# EAGLE design tinyha_relay (EAGLE 7.5.0)
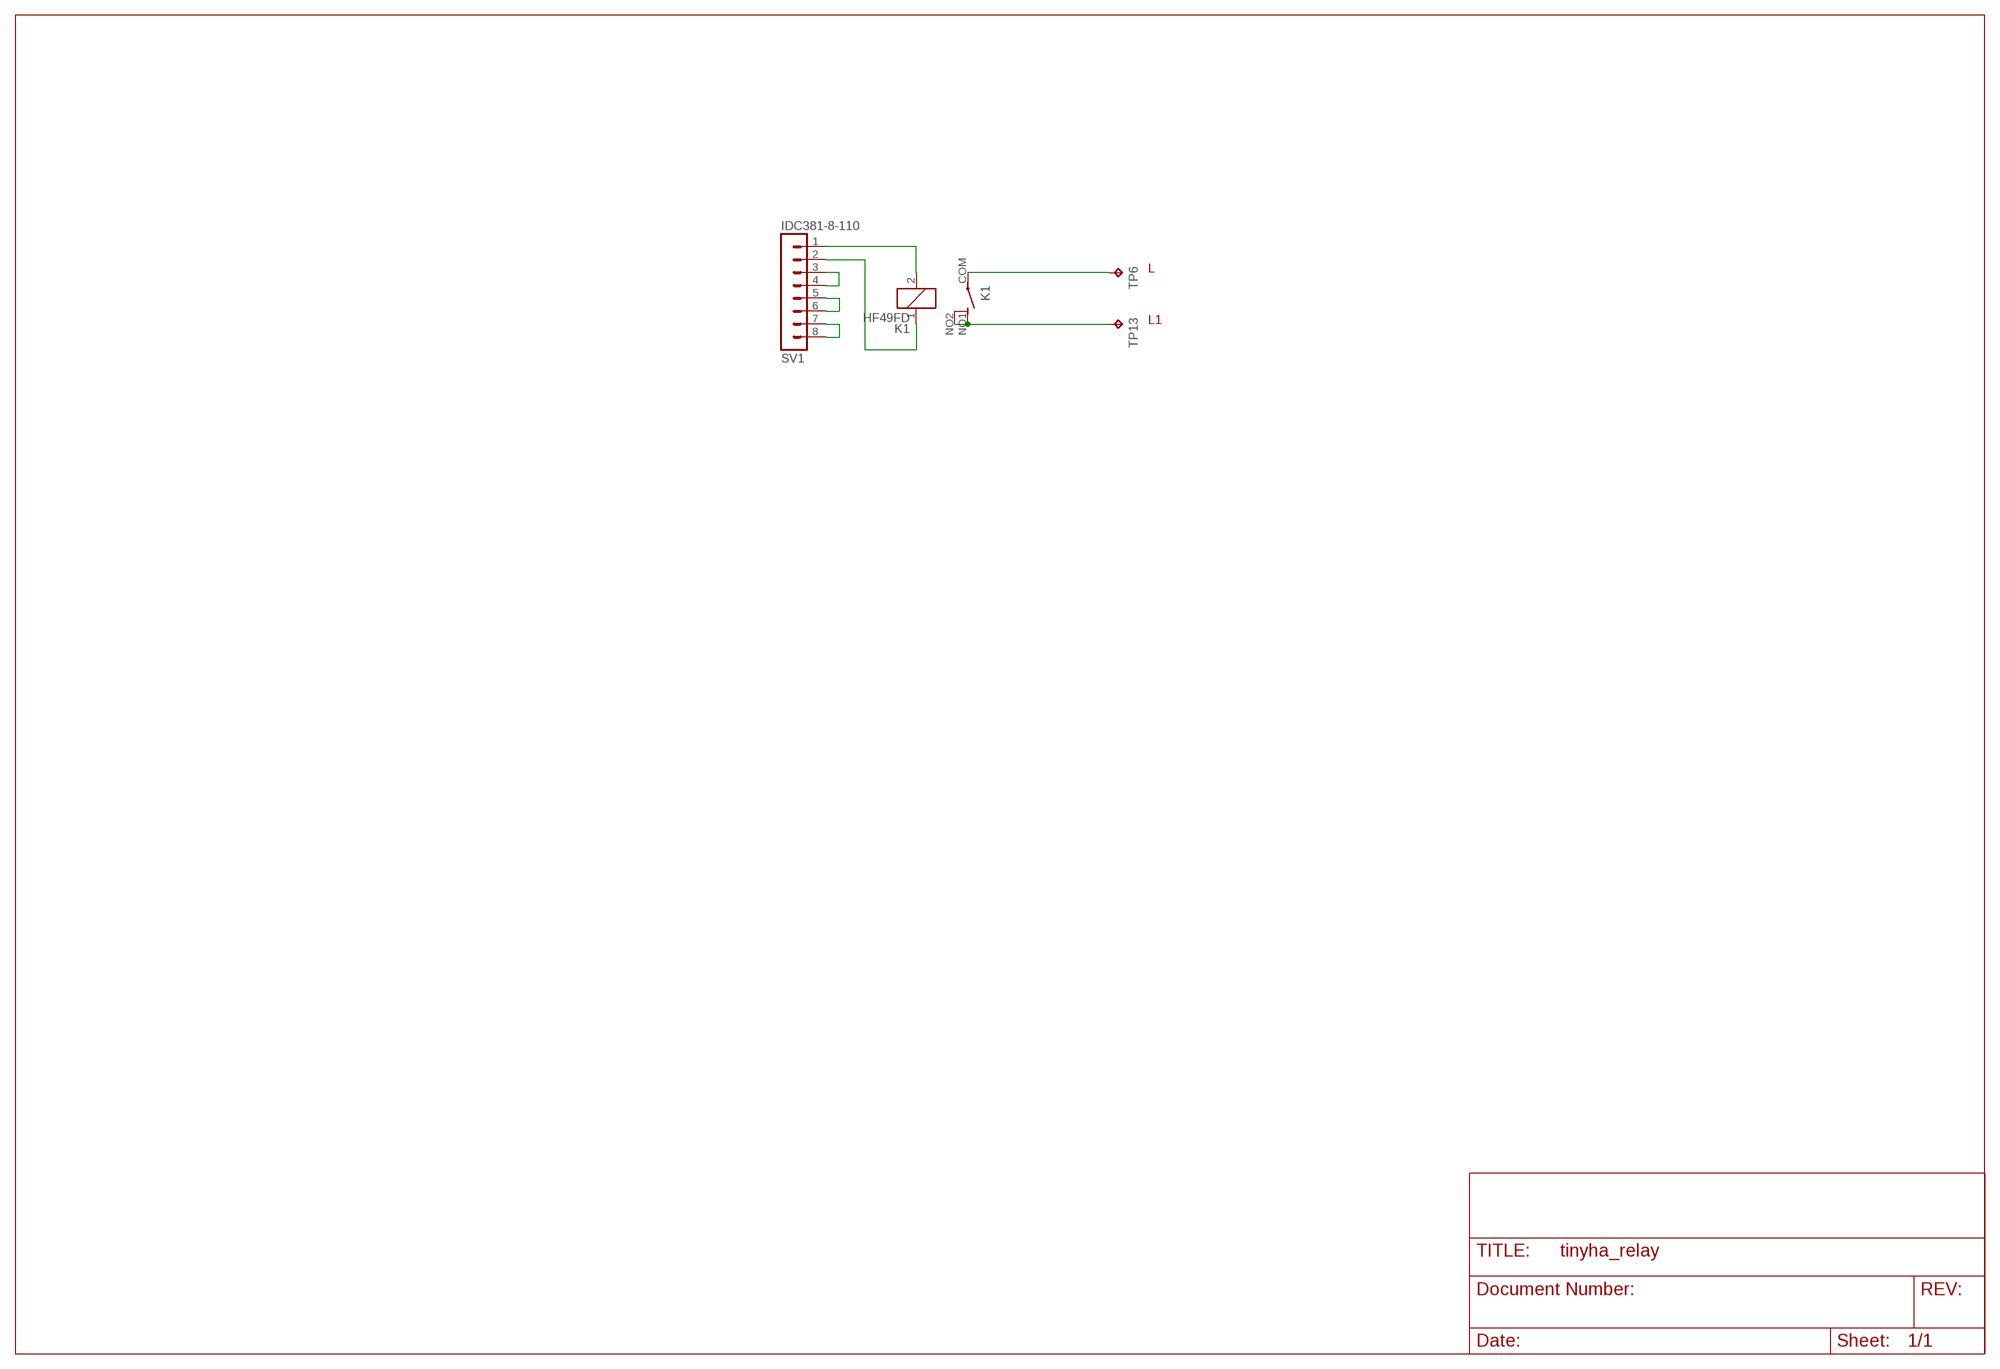
[diagram p0: schematic, sheet 1]

## Parts
K1  HF49FD  [HF49D]
SV1  IDC381-8-110  MA08-1-IDC  [IDC381-8]
TP6  TP230  [P1-20]
TP13  TP230  [P1-20]

## Nets
N$1: SV1.5 SV1.6
N$3: K1.NO1(S1) K1.NO2(S2) TP13.TP
N$4: SV1.3 SV1.4
N$5: K1.2 SV1.1
N$6: K1.1 SV1.2
N$10: SV1.7 SV1.8
N$16: K1.COM(P) TP6.TP

## Notes on the sheet
- L
- L1

## Library data of the parts
K1 = custom:HF49FD
SV1 = custom:MA08-1: PIN HEADER
TP6 TP13 = custom:TP230

## Board
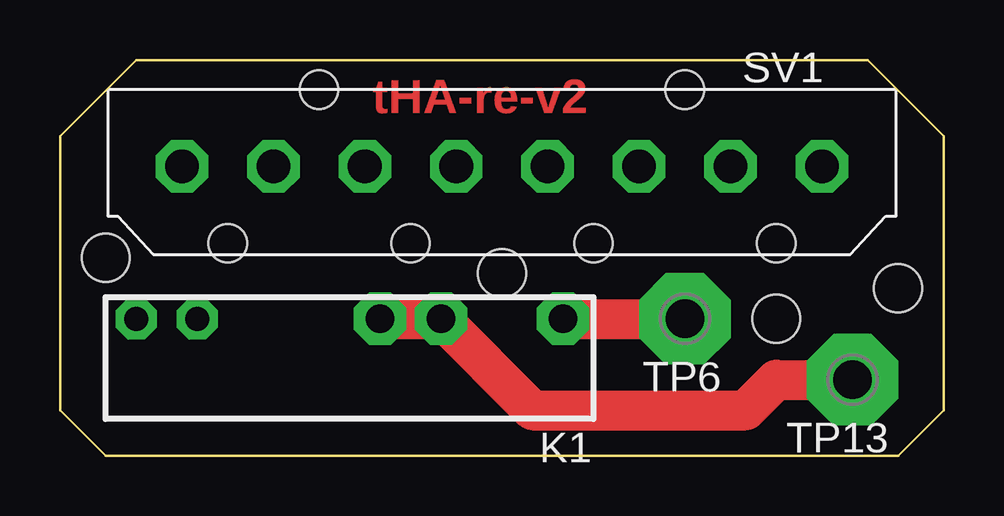
[diagram p1: board, top side]
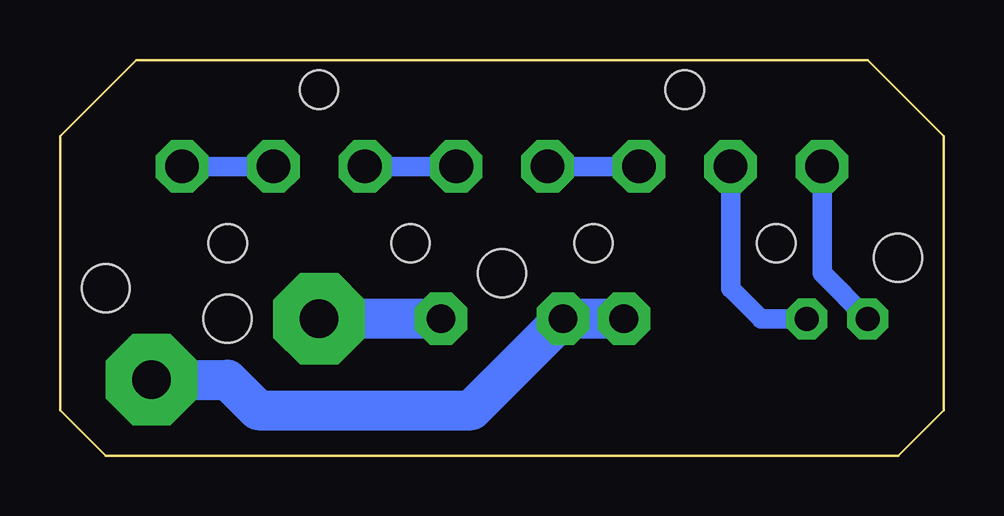
[diagram p2: board, bottom side, seen from below]

Size 36.83 x 16.51 mm. Coordinates in mm from the lower left corner, seen from the top.
Outline: 33.66,16.51 3.17,16.51 0,13.34 0,1.91 1.91,0 34.92,0 36.83,1.91 36.83,13.34 33.66,16.51
Copper layers (1*16): Top 0.035mm / dielectric 1.5mm / Bottom 0.035mm
Design rules "temp *": minimum track width 10mil, minimum drill 0.5mm, track to track 0.19mm, track to pad 0.19mm, pad to pad 0.19mm, via to via 0.2mm, smd to smd 0mil, copper to edge 16mil, drill to drill 8mil, minimum pad ring 14mil, minimum via ring 10mil, stop-mask expansion 4mil, vias tented up to drill 0.6mm, thermal gap 16mil
Holes 2 mm at 18.41,7.62 1.91,8.26 34.92,6.99 29.84,5.71

### Footprints (pad centres in the part's own frame; a part is rotated, then mirrored left to right if it is on the bottom)
HF49D = drill 1 pad 1.676 octagon: 1 7.62,0; 2 10.16,0 | drill 1.2 pad 2.184 octagon: COM -7.62,0; NO1 -2.54,0; NO2 0,0
IDC381-8 = drill 1.4 pad 2.184 octagon: 1 -13.335,0; 2 -9.525,0; 3 -5.715,0; 4 -1.905,0; 5 1.905,0; 6 5.715,0; 7 9.525,0; 8 13.335,0 | hole 1.6: -11.43,-3.2; -3.81,-3.2; 3.81,-3.2; 11.43,-3.2; -7.62,3.2; 7.62,3.2
P1-20 = drill 1.6 pad 3.81 octagon: TP 0,0

### Placement (x,y rotation side)
K1  13.34,5.71 180 top
SV1  18.41,12.06 0 top
TP6  26.04,5.71 180 top
TP13  33.02,3.17 180 top

### Tracks (layer width: path | path; a pad name or v marks a point on that pad's centre or on a via)
N$1
  Bottom 0.813: SV1.6 SV1.5
N$3
  Top 1.676: K1.NO2 K1.NO1 19.68,1.91 28.57,1.91 29.84,3.17 TP13.TP
  Bottom 1.676: K1.NO2 K1.NO1 19.68,1.91 28.57,1.91 29.84,3.17 TP13.TP
N$4
  Bottom 0.813: SV1.3 SV1.4
N$5
  Bottom 0.813: K1.2 5.08,7.62 SV1.1
N$6
  Bottom 0.813: K1.1 7.62,5.71 8.89,6.99 SV1.2
N$10
  Bottom 0.813: SV1.8 SV1.7
N$16
  Top 1.676: K1.COM TP6.TP
  Bottom 1.676: K1.COM TP6.TP

### Text on the board
Top: tHA-re-v2